# EAGLE board tarjeta-v8 (EAGLE 6.4)
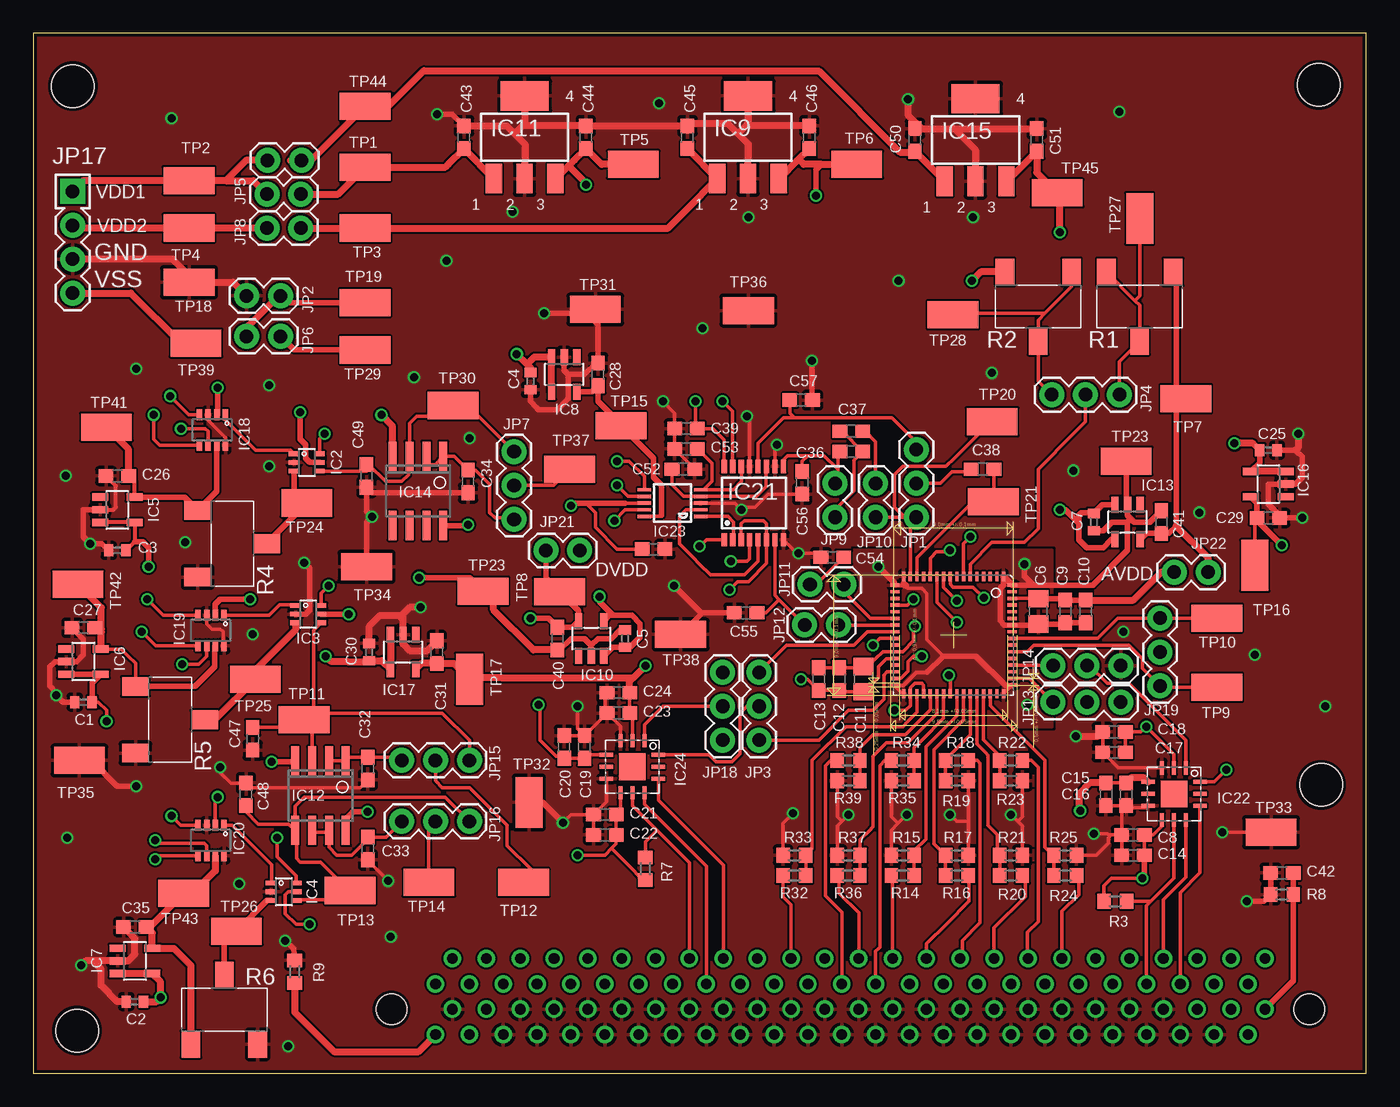
[diagram p3: board, top side]
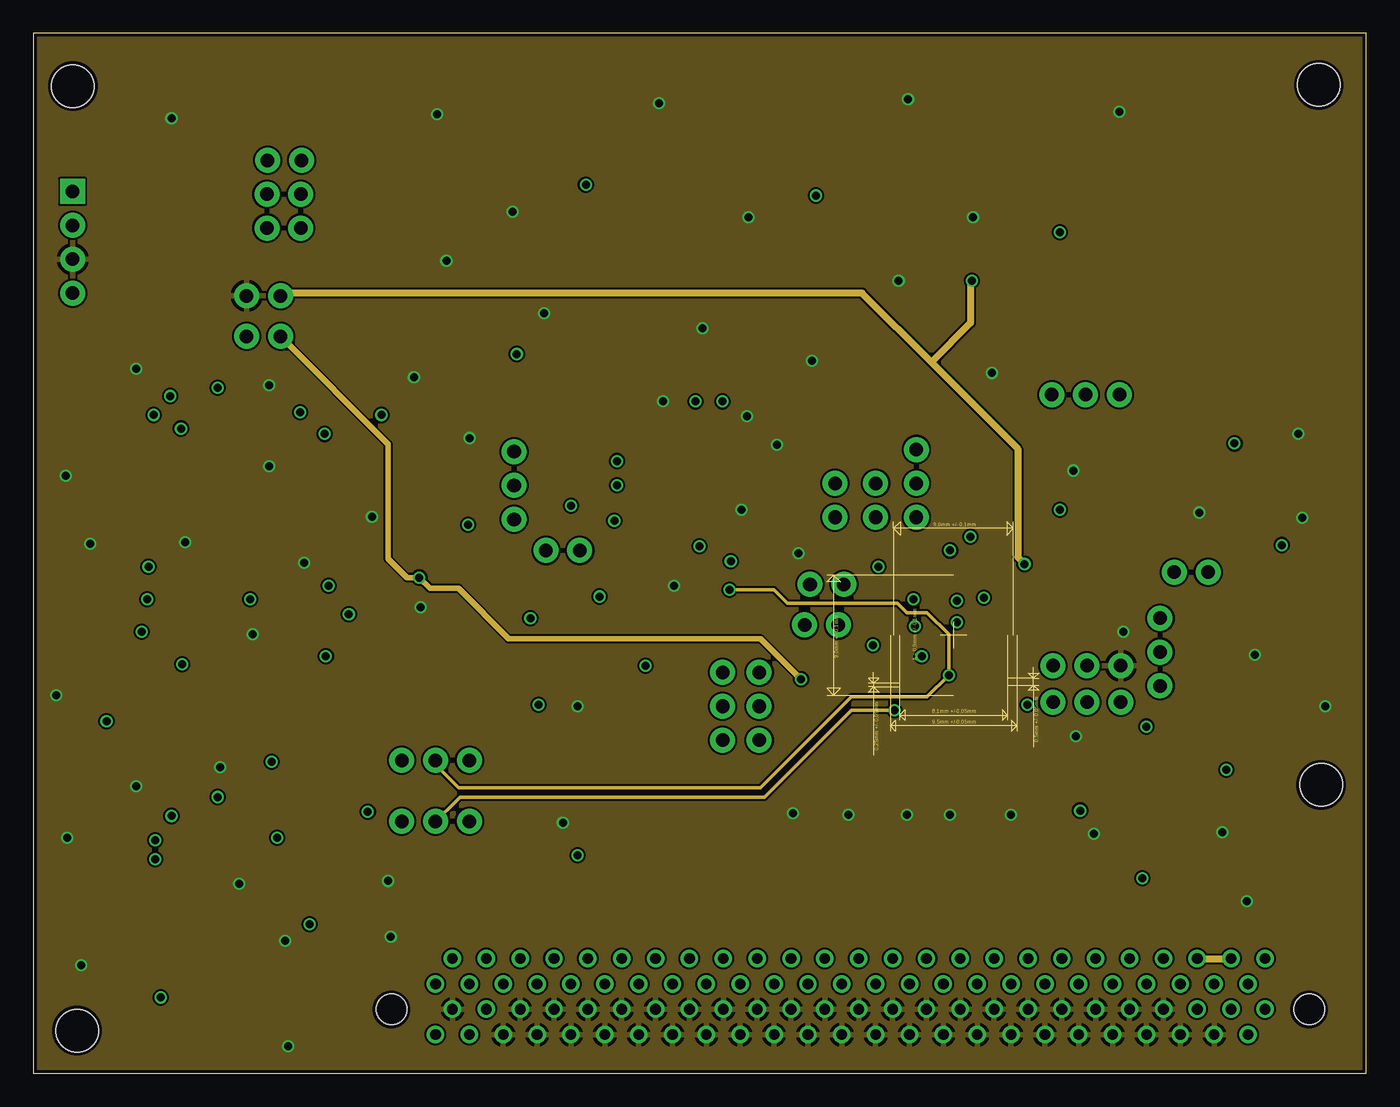
[diagram p4: board, inner layer Route2]
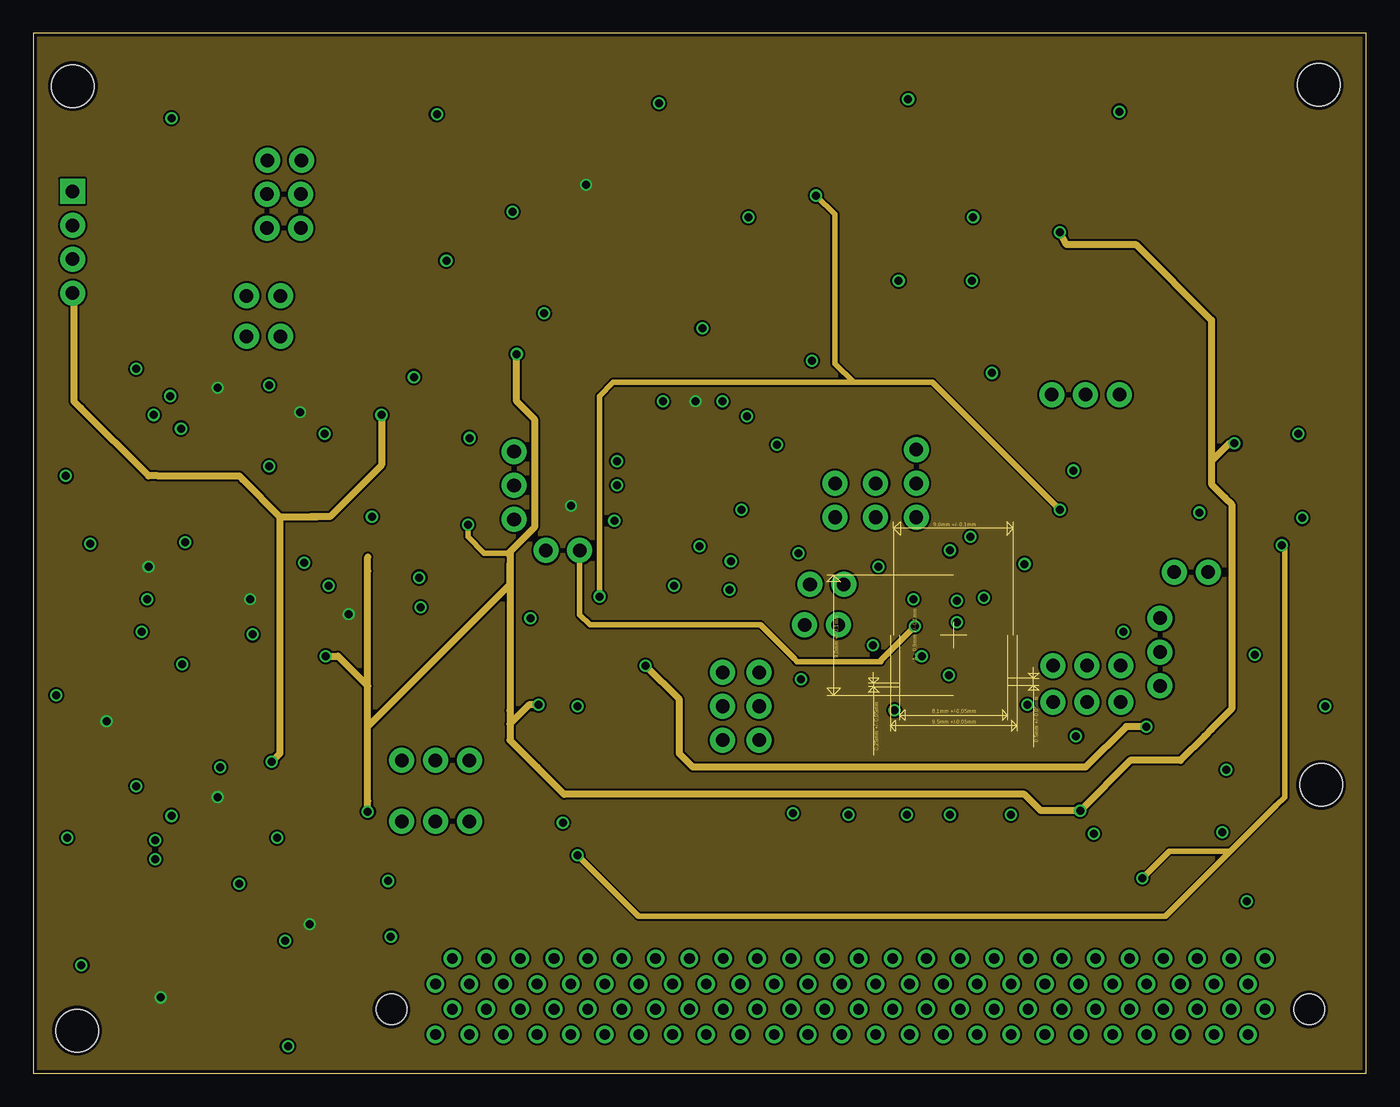
[diagram p5: board, inner layer Route3]
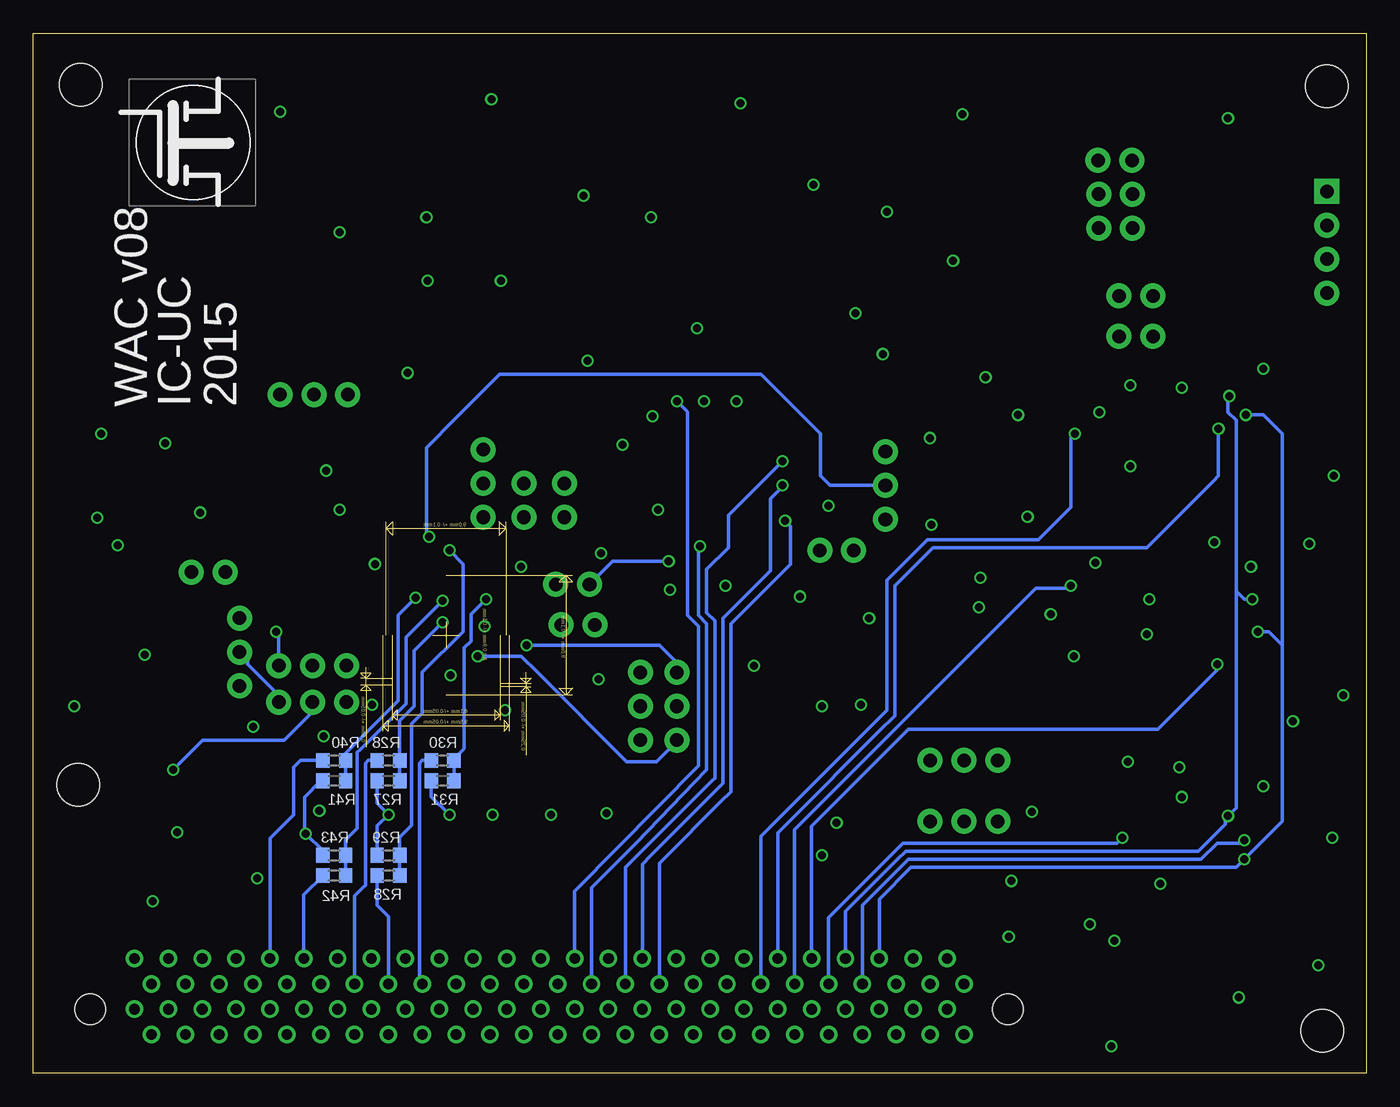
[diagram p6: board, bottom side, seen from below]

Size 100 x 78 mm. Coordinates in mm from the lower left corner, seen from the top.
Outline: 0,0 97.94,0 98.55,0 100,0 99.99,78 0,78 0,0
Copper layers [2:(1*2*3*16):3]: Top 0.035mm / dielectric 1.5mm / Route2 0.035mm / dielectric 0.15mm / Route3 0.035mm / dielectric 0.2mm / Bottom 0.035mm
Design rules "ITEADstudio_DRC": minimum track width 6mil, minimum drill 12mil, track to track 6mil, track to pad 6mil, pad to pad 6mil, via to via 6mil, smd to smd 0mil, copper to edge 10mil, drill to drill 10mil, minimum pad ring 10mil, minimum via ring 6mil, stop-mask expansion 2mil, vias tented up to drill 100mil, thermal gap 10mil
Holes 3.2 mm at 3.28,3.2 2.97,74.04 96.45,74.14 96.62,21.64

## Footprints (pad centres in the part's own frame; a part is rotated, then mirrored left to right if it is on the bottom)
C0402 = smd 0.7 x 0.9: 1 -0.65,0; 2 0.65,0
C0805 = smd 1.3 x 1.5: 1 -0.95,0; 2 0.95,0
C0603 = smd 1.1 x 1: 1 -0.85,0; 2 0.85,0
QFN64 = smd 0.7 x 0.25: 1 -14.56,5.02; 2 -14.56,4.52; 3 -14.56,4.02; 4 -14.56,3.52; 5 -14.56,3.02; 6 -14.56,2.52; 7 -14.56,2.02; 8 -14.56,1.52; 9 -14.56,1.02; 10 -14.56,0.52; 11 -14.56,0.02; 12 -14.56,-0.48; 13 -14.56,-0.98; 14 -14.56,-1.48; 15 -14.56,-1.98; 16 -14.56,-2.48; 33 -5.76,-2.48; 34 -5.76,-1.98; 35 -5.76,-1.48; 36 -5.76,-0.98; 37 -5.76,-0.48; 38 -5.76,0.02; 39 -5.76,0.52; 40 -5.76,1.02; 41 -5.76,1.52; 42 -5.76,2.02; 43 -5.76,2.52; 44 -5.76,3.02; 45 -5.76,3.52; 46 -5.76,4.02; 47 -5.76,4.52; 48 -5.76,5.02 | smd 0.25 x 0.7: 17 -13.91,-3.13; 18 -13.41,-3.13; 19 -12.91,-3.13; 20 -12.41,-3.13; 21 -11.91,-3.13; 22 -11.41,-3.13; 23 -10.91,-3.13; 24 -10.41,-3.13; 25 -9.91,-3.13; 26 -9.41,-3.13; 27 -8.91,-3.13; 28 -8.41,-3.13; 29 -7.91,-3.13; 30 -7.41,-3.13; 31 -6.91,-3.13; 32 -6.41,-3.13; 49 -6.41,5.67; 50 -6.91,5.67; 51 -7.41,5.67; 52 -7.91,5.67; 53 -8.41,5.67; 54 -8.91,5.67; 55 -9.41,5.67; 56 -9.91,5.67; 57 -10.41,5.67; 58 -10.91,5.67; 59 -11.41,5.67; 60 -11.91,5.67; 61 -12.41,5.67; 62 -12.91,5.67; 63 -13.41,5.67; 64 -13.91,5.67
SC70 = smd 0.35 x 0.8: 1 -0.65,-0.95; 2 0,-0.95; 3 0.65,-0.95; 4 0.65,0.95; 5 0,0.95; 6 -0.65,0.95
SOT23-5L_2 = smd 0.55 x 1.2: 1 -0.95,-1.3; 2 0,-1.3; 3 0.95,-1.3; 4 0.95,1.3; 5 -0.95,1.3
SOT223 = smd 1.219 x 2.235: 1 -2.438,-3.099; 2 -0.127,-3.099; 3 2.184,-3.099 | smd 3.6 x 2.2: 4 -0.127,3.099
SOIC8 = smd 0.6 x 2.2: 1 -1.905,-2.6; 2 -0.635,-2.6; 3 0.635,-2.6; 4 1.905,-2.6; 5 1.905,2.6; 6 0.635,2.6; 7 -0.635,2.6; 8 -1.905,2.6
SOT23-8_2 = smd 0.406 x 0.813: 1 -1,-1.04; 2 -0.35,-1.04; 3 0.3,-1.04; 4 0.95,-1.04; 5 0.95,1.26; 6 0.3,1.26; 7 -0.35,1.26; 8 -1,1.26
QSOP16 = smd 0.4 x 1: 1 -2.223,-2.75; 2 -1.588,-2.75; 3 -0.953,-2.75; 4 -0.318,-2.75; 5 0.318,-2.75; 6 0.953,-2.75; 7 1.588,-2.75; 8 2.223,-2.75; 9 2.223,2.75; 10 1.588,2.75; 11 0.953,2.75; 12 0.318,2.75; 13 -0.318,2.75; 14 -0.953,2.75; 15 -1.588,2.75; 16 -2.223,2.75
TQFN12 = smd 1 x 0.3: P$1 0.05,-1.1; P$2 0.05,-2; P$3 0.05,-2.9; P$7 3.95,-2.9; P$8 3.95,-2; P$9 3.95,-1.1 | smd 0.3 x 1: P$4 1.1,-3.95; P$5 2,-3.95; P$6 2.9,-3.95; P$10 2.9,-0.05; P$11 2,-0.05; P$12 1.1,-0.05 | smd 2 x 2: P$13 2,-2
MSOP10 = smd 0.25 x 1: 1 -1,-2.113; 2 -0.5,-2.113; 3 0,-2.113; 4 0.5,-2.113; 5 1,-2.113; 6 1,2.113; 7 0.5,2.113; 8 0,2.113; 9 -0.5,2.113; 10 -1,2.113
FX2-100S-1.27 = drill 0.8: A1 0,0; A2 -1.27,-1.905; A3 -2.54,0; A4 -3.81,-1.905; A5 -5.08,0; A6 -6.35,-1.905; A7 -7.62,0; A8 -8.89,-1.905; A9 -10.16,0; A10 -11.43,-1.905; A11 -12.7,0; A12 -13.97,-1.905; A13 -15.24,0; A14 -16.51,-1.905; A15 -17.78,0; A16 -19.05,-1.905; A17 -20.32,0; A18 -21.59,-1.905; A19 -22.86,0; A20 -24.13,-1.905; A21 -25.4,0; A22 -26.67,-1.905; A23 -27.94,0; A24 -29.21,-1.905; A25 -30.48,0; A26 -31.75,-1.905; A27 -33.02,0; A28 -34.29,-1.905; A29 -35.56,0; A30 -36.83,-1.905; A31 -38.1,0; A32 -39.37,-1.905; A33 -40.64,0; A34 -41.91,-1.905; A35 -43.18,0; A36 -44.45,-1.905; A37 -45.72,0; A38 -46.99,-1.905; A39 -48.26,0; A40 -49.53,-1.905; A41 -50.8,0; A42 -52.07,-1.905; A43 -53.34,0; A44 -54.61,-1.905; A45 -55.88,0; A46 -57.15,-1.905; A47 -58.42,0; A48 -59.69,-1.905; A49 -60.96,0; A50 -62.23,-1.905; B1 0,3.8; B2 -1.27,1.895; B3 -2.54,3.8; B4 -3.81,1.895; B5 -5.08,3.8; B6 -6.35,1.895; B7 -7.62,3.8; B8 -8.89,1.895; B9 -10.16,3.8; B10 -11.43,1.895; B11 -12.7,3.8; B12 -13.97,1.895; B13 -15.24,3.8; B14 -16.51,1.895; B15 -17.78,3.8; B16 -19.05,1.895; B17 -20.32,3.8; B18 -21.59,1.895; B19 -22.86,3.8; B20 -24.13,1.895; B21 -25.4,3.8; B22 -26.67,1.895; B23 -27.94,3.8; B24 -29.21,1.895; B25 -30.48,3.8; B26 -31.75,1.895; B27 -33.02,3.8; B28 -34.29,1.895; B29 -35.56,3.8; B30 -36.83,1.895; B31 -38.1,3.8; B32 -39.37,1.895; B33 -40.64,3.8; B34 -41.91,1.895; B35 -43.18,3.8; B36 -44.45,1.895; B37 -45.72,3.8; B38 -46.99,1.895; B39 -48.26,3.8; B40 -49.53,1.895; B41 -50.8,3.8; B42 -52.07,1.895; B43 -53.34,3.8; B44 -54.61,1.895; B45 -55.88,3.8; B46 -57.15,1.895; B47 -58.42,3.8; B48 -59.69,1.895; B49 -60.96,3.8; B50 -62.23,1.895 | hole 2.3: -65.54,1.905; 3.31,1.905
1X03 = drill 1.016 pad 1.88: 1 -2.54,0; 2 0,0; 3 2.54,0
1X02 = drill 1.016 pad 1.88: 1 -1.27,0; 2 1.27,0
1X04 = drill 1.016 pad 1.88 square: 1 0,0 | drill 1.016 pad 1.88: 2 2.54,0; 3 5.08,0; 4 7.62,0
ST-5EW = smd 1.4 x 2: 1 -2.5,-2.6; 2 0,2.6; 3 2.5,-2.6
R0603 = smd 1 x 1.1: 1 -0.85,0; 2 0.85,0
TP = smd 3.81 x 2.032: TP 0,0

## Placement (x,y rotation side)
C1  [C0402]  3.76,27.84 180 top
C2  4.7uf  [C0402]  7.62,5.38 180 top
C3  [C0402]  6.3,39.22 180 top
C4  4.7uf  [C0402]  37.29,51.92 270 top
C5  [C0402]  44.4,32.61 90 top
C6  [C0805]  75.39,34.65 270 top
C7  [C0402]  79.55,41.35 270 top
C8  CAP_0603  [C0603]  82.5,17.88 180 top
C9  CAP_0603  [C0603]  77.42,34.65 270 top
C10  CAP_0603  [C0603]  78.94,34.65 270 top
C11  [C0805]  62.28,29.57 270 top
C12  CAP_0603  [C0603]  60.45,29.57 270 top
C13  CAP_0603  [C0603]  58.93,29.57 270 top
C14  CAP_0603  [C0603]  82.5,16.36 180 top
C15  CAP_0603  [C0603]  81.99,20.93 270 top
C16  CAP_0603  [C0603]  80.47,20.93 270 top
C17  CAP_0603  [C0603]  81.08,24.08 180 top
C18  CAP_0603  [C0603]  81.08,25.6 180 top
C19  CAP_0603  [C0603]  41.35,24.49 90 top
C20  CAP_0603  [C0603]  39.83,24.49 90 top
C21  CAP_0603  [C0603]  42.88,19.41 180 top
C22  CAP_0603  [C0603]  42.88,17.88 180 top
C23  CAP_0603  [C0603]  43.89,27.03 180 top
C24  CAP_0603  [C0603]  43.89,28.55 180 top
C25  [C0402]  92.66,46.74 0 top
C26  CAP_0603  [C0603]  6.3,44.81 180 top
C27  CAP_0603  [C0603]  3.76,33.43 180 top
C28  0.1uf  [C0603]  42.37,52.43 90 top
C29  0.1uf  [C0603]  92.66,41.66 0 top
C30  4.7uf  [C0402]  25.2,31.6 90 top
C31  0.1uf  [C0603]  30.28,31.6 90 top
C32  CAP_0603  [C0603]  25.1,22.86 270 top
C33  CAP_0603  [C0603]  25.1,16.87 270 top
C34  4.7uf  [C0603]  32.62,44.4 270 top
C35  0.1uf  [C0603]  7.62,10.97 180 top
C36  CAP_0603  [C0603]  61.37,46.63 0 top
C37  CAP_0603  [C0603]  61.37,48.16 0 top
C38  CAP_0603  [C0603]  71.22,45.31 0 top
C39  0.1uF  [C0603]  48.97,48.36 0 top
C40  CAP_0603  [C0603]  39.32,32.61 270 top
C41  CAP_0603  [C0603]  84.63,41.35 90 top
C42  1nf  [C0603]  93.68,15.04 180 top
C43  CAP_0603  [C0603]  32.31,70.21 90 top
C44  CAP_0603  [C0603]  41.45,70.21 90 top
C45  CAP_0603  [C0603]  49.07,70.21 90 top
C46  CAP_0603  [C0603]  58.22,70.21 90 top
C47  CAP_0603  [C0603]  16.46,25.1 270 top
C48  CAP_0603  [C0603]  15.95,20.93 90 top
C49  CAP_0603  [C0603]  25,44.81 270 top
C50  CAP_0603  [C0603]  66.14,70 90 top
C51  CAP_0603  [C0603]  75.29,70 90 top
C52  CAP_0603  [C0603]  48.77,45.31 0 top
C53  CAP_0603  [C0603]  48.97,46.84 180 top
C54  CAP_0603  [C0603]  59.95,38.71 180 top
C55  CAP_0603  [C0603]  53.44,34.54 180 top
C56  CAP_0603  [C0603]  57.69,44.3 270 top
C57  CAP_0603  [C0603]  57.61,50.5 0 top
C58  0.1uF  [C0603]  46.53,39.32 180 top
IC1  THE_BEAN_2  [QFN64]  67.77,22.71 270 top
IC2  [SC70]  20.52,45.82 270 top
IC3  [SC70]  20.63,34.44 270 top
IC4  [SC70]  18.8,13.61 270 top
IC5  1.8V  [SOT23-5L_2]  6.3,42.27 270 top
IC6  1.8V  [SOT23-5L_2]  3.76,30.89 270 top
IC7  1.8V  [SOT23-5L_2]  7.62,8.43 270 top
IC8  1.8V  [SOT23-5L_2]  39.83,52.43 180 top
IC9  [SOT223]  53.75,70.21 0 top
IC10  1.8  [SOT23-5L_2]  41.86,32.61 0 top
IC11  [SOT223]  36.98,70.21 0 top
IC12  OP282  [SOIC8]  21.54,20.83 180 top
IC13  1.8  [SOT23-5L_2]  82.09,41.35 180 top
IC14  OP282  [SOIC8]  28.86,43.69 180 top
IC15  [SOT223]  70.82,70 0 top
IC16  1.8V  [SOT23-5L_2]  92.66,44.2 90 top
IC17  1.8V  [SOT23-5L_2]  27.74,31.6 180 top
IC18  AD5160_2  [SOT23-8_2]  13.41,48.36 180 top
IC19  AD5160_2  [SOT23-8_2]  13.31,33.32 180 top
IC20  AD5160_2  [SOT23-8_2]  13.31,17.58 180 top
IC21  [QSOP16]  54.05,42.77 0 top
IC22  [TQFN12]  87.58,22.96 270 top
IC23  DAC7554  [MSOP10]  47.96,42.77 90 top
IC24  [TQFN12]  46.94,24.99 270 top
J1  HIRESO_FX_CONNECTOR  [FX2-100S-1.27]  30.18,6.71 180 top
JP1  JUMPER03  [1X03]  66.24,44.25 270 top
JP2  JUMPER02  [1X02]  17.27,58.32 0 top
JP3  JUMPER03  [1X03]  54.46,27.53 90 top
JP4  JUMPER03  [1X03]  78.94,50.9 0 top
JP5  JUMPER02  [1X02]  18.8,65.94 180 top
JP6  JUMPER02  [1X02]  17.27,55.27 180 top
JP7  JUMPER03  [1X03]  36.07,44.09 90 top
JP8  JUMPER02  [1X02]  18.8,63.4 180 top
JP9  JUMPER02  [1X02]  60.15,42.98 270 top
JP10  JUMPER02  [1X02]  63.2,42.98 270 top
JP11  JUMPER02  [1X02]  59.54,36.68 0 top
JP12  JUMPER02  [1X02]  59.13,33.63 0 top
JP13  JUMPER03  [1X03]  79.05,27.84 180 top
JP14  JUMPER03  [1X03]  79.05,30.58 180 top
JP15  JUMPER03  [1X03]  30.18,23.47 0 top
JP16  JUMPER03  [1X03]  30.18,18.9 0 top
JP17  JUMPER04  [1X04]  2.95,66.14 270 top
JP18  JUMPER03  [1X03]  51.72,27.53 90 top
JP19  JUMPER03  [1X03]  84.53,31.6 270 top
JP20  JUMPER02  [1X02]  18.85,68.48 180 top
JP21  JUMPER02  [1X02]  39.73,39.22 0 top
JP22  JUMPER02  [1X02]  86.87,37.59 0 top
R1  [ST-5EW]  83.01,57.51 180 top
R2  [ST-5EW]  75.39,57.51 180 top
R3  RES_0603  [R0603]  81.18,12.9 180 top
R4  [ST-5EW]  14.94,39.73 270 top
R5  [ST-5EW]  10.26,26.52 270 top
R6  [ST-5EW]  14.33,4.78 0 top
R7  RES_0603  [R0603]  45.92,15.34 270 top
R8  1M  [R0603]  93.68,13.41 0 top
R9  RES_0603  [R0603]  19.61,7.62 270 top
R14  RES_0603  [R0603]  65.23,14.83 180 top
R15  RES_0603  [R0603]  65.23,16.36 0 top
R16  RES_0603  [R0603]  69.29,14.83 0 top
R17  RES_0603  [R0603]  69.29,16.36 180 top
R18  RES_0603  [R0603]  69.29,23.47 0 top
R19  RES_0603  [R0603]  69.29,21.95 180 top
R20  RES_0603  [R0603]  73.36,14.83 0 top
R21  RES_0603  [R0603]  73.36,16.36 180 top
R22  RES_0603  [R0603]  73.36,23.47 0 top
R23  RES_0603  [R0603]  73.36,21.95 180 top
R24  RES_0603  [R0603]  77.42,14.83 0 top
R25  RES_0603  [R0603]  77.42,16.36 180 top
R26  RES_0603  [R0603]  73.36,23.47 180 bottom
R27  RES_0603  [R0603]  73.36,21.95 0 bottom
R28  RES_0603  [R0603]  73.36,14.83 180 bottom
R29  RES_0603  [R0603]  73.36,16.36 0 bottom
R30  RES_0603  [R0603]  69.29,23.47 180 bottom
R31  RES_0603  [R0603]  69.29,21.95 0 bottom
R32  RES_0603  [R0603]  57.1,14.83 180 top
R33  RES_0603  [R0603]  57.1,16.36 0 top
R34  0  [R0603]  65.23,23.47 180 top
R35  0  [R0603]  65.23,21.95 0 top
R36  RES_0603  [R0603]  61.16,14.83 180 top
R37  RES_0603  [R0603]  61.16,16.36 0 top
R38  RES_0603  [R0603]  61.16,23.47 180 top
R39  RES_0603  [R0603]  61.16,21.95 0 top
R40  RES_0603  [R0603]  77.42,23.47 180 bottom
R41  RES_0603  [R0603]  77.42,21.95 0 bottom
R42  RES_0603  [R0603]  77.42,14.83 180 bottom
R43  RES_0603  [R0603]  77.42,16.36 0 bottom
TP1  [TP]  24.89,67.97 0 top
TP2  [TP]  11.69,66.95 0 top
TP3  [TP]  24.89,63.4 0 top
TP4  [TP]  11.69,63.4 0 top
TP5  [TP]  45.01,68.17 0 top
TP6  [TP]  61.77,68.17 0 top
TP7  [TP]  86.46,50.6 180 top
TP8  [TP]  39.47,36.12 0 top
TP9  [TP]  88.8,28.96 0 top
TP10  [TP]  88.8,34.14 0 top
TP11  [TP]  20.32,26.52 0 top
TP12  [TP]  36.78,14.33 0 top
TP13  [TP]  23.78,13.72 0 top
TP14  [TP]  29.67,14.33 0 top
TP15  [TP]  44.1,48.56 0 top
TP16  [TP]  91.64,38.1 90 top
TP17  [TP]  32.72,29.57 270 top
TP18  [TP]  11.69,59.33 0 top
TP19  [TP]  24.89,57.81 0 top
TP20  [TP]  71.93,48.87 180 top
TP21  [TP]  72.04,42.88 180 top
TP22  [TP]  81.99,45.92 0 top
TP23  [TP]  33.73,36.17 0 top
TP24  [TP]  20.52,42.77 0 top
TP25  [TP]  16.66,29.57 0 top
TP26  [TP]  15.24,10.67 0 top
TP27  [TP]  83.01,64.11 90 top
TP28  [TP]  68.99,56.9 180 top
TP29  [TP]  24.89,54.25 0 top
TP30  [TP]  31.5,50.09 0 top
TP31  [TP]  42.17,57.3 0 top
TP32  [TP]  37.19,20.32 90 top
TP33  [TP]  92.86,18.08 0 top
TP34  [TP]  25,38 0 top
TP35  [TP]  3.46,23.47 0 top
TP36  [TP]  53.65,57.2 0 top
TP37  [TP]  40.24,45.31 0 top
TP38  [TP]  48.57,32.92 0 top
TP39  [TP]  12.19,54.76 0 top
TP41  [TP]  5.49,48.46 0 top
TP42  [TP]  3.35,36.68 0 top
TP43  [TP]  11.28,13.51 0 top
TP44  [TP]  24.89,72.54 0 top
TP45  [TP]  76.81,66.04 0 top
U$1  LOGO  [LOGO]  83.31,74.57 270 top

## Tracks (layer width: path | path; a pad name or v marks a point on that pad's centre or on a via)
!CS_ADC1
  Top 0.254: IC22.P$9 86.48,14.71 84.79,13.02 J1.A44
!CS_ADC2
  Top 0.254: IC24.P$9 45.84,20.2 50.29,15.75 50.5,15.54 J1.A17
!CS_DAC  (via drill 0.6)
  Top 0.254: IC23.9 44.41,42.27 v43.59,41.45
  Bottom 0.254: v43.59,41.45 43.18,41.05 43.18,38.2 47.25,34.14 47.65,33.73 47.65,21.54 47.65,21.13 48.46,20.32 52.68,16.1 53.04,15.75 J1.A19
ADC1_IN+  (via drill 0.6)
  Top 0.254: IC22.P$12 88.61,21.86 v89.51,22.76
  Bottom 0.254: JP13.2 79.05,27.13 81.18,24.99 87.28,24.99 v89.51,22.76
ADC1_IN-
  Top 0.254: JP14.2 79.25,30.58 80.57,29.26 82.2,29.26 84.02,27.43 86.48,24.98 IC22.P$1
ADC2_IN+
  Top 0.254: JP3.2 53.54,27.53 53.04,27.03 53.04,23.98 52.53,23.47 52.43,23.37 51.21,23.37 50.68,23.89 IC24.P$12
ADC2_IN-
  Top 0.254: JP18.2 47.25,27.53 45.92,26.21 45.84,26.13 IC24.P$1
AGND  (via drill 0.6)
  Top 0.254: IC1.48 IC1.49 | 81.99,42.75 IC13.2 | IC1.16 65.29,36.72 | IC1.32 64.64,29.04 65.23,28.45 | 64.62,36.78 64.62,36.58 65.43,36.58 65.64,36.37 66.65,36.37 67.06,35.97 67.06,32.51 68.28,31.29
  Top 0.305: IC1.32 65.29,29.12 66.24,30.07 67.06,30.07
  Top 0.406: 18.39,58.32 JP2.2 19.05,57.81 TP19.TP | 16.16,55.42 JP6.2 | C10.2 C9.2 77.32,33.7 C6.2 75.31,33.62 IC1.58 72.86,33.62 72.54,33.93 72.54,36.37 72.79,36.62 IC1.1 IC1.64 75.02,36.62 | IC13.2 82.09,41.86 82.35,41.6 | 82.35,41.6 82.6,41.35 83.78,41.35 C41.2 84.74,42.3 | C7.2 80.27,40.7 80.92,41.35 82.09,41.35 | 82.09,41.35 82.35,41.6 | 75.02,36.62 79.49,36.62 82.09,39.22 82.09,41.35 | v74.37,38.2 74.37,37.27 75.02,36.62 | TP22.TP 81.99,42.75 | 64.62,36.78 v63.4,38 63.4,38.2 | 67.06,30.07 68.28,31.29 70.72,31.29 72.95,29.06 73.38,29.06 IC1.49
  Top 0.508: 18.39,58.32 16.16,56.08 16.16,55.42 | v70.41,59.44 71.08,60.11 R2.3 | 65.29,36.72 65.43,36.58
  Route2 0.406: JP2.2 18.39,58.32
  Route2 0.508: 67.36,53.34 62.18,58.52 18.75,58.52 JP2.2 | 67.36,53.34 73.86,46.84 73.86,38.71 v74.37,38.2 | 67.36,53.34 70.31,56.29 70.31,59.33 v70.41,59.44
  other vias: 74.58,27.64
  pour Top: 76.4,39.22 60.66,39.22 60.66,26.01 76.4,26.01
AVDD
  Top 0.406: IC13.5 83.49,40.5 C41.1 85.21,40.5 85.75,41.05 85.75,50.7 | 85.85,60.55 85.85,60.45 R1.1 85.75,59.86 85.75,50.7 | TP7.TP 85.85,50.6 85.75,50.7
  Top 0.508: JP22.2 88.14,38.66 85.75,41.05
AVDD_BEAN
  Top 0.254: IC1.62 75.37,35.62 C6.1
  Top 0.406: C10.1 C9.1 77.32,35.6 C6.1
  Top 0.508: C10.1 82.54,35.5 84.63,37.59 JP22.1
BASELINE
  Top 0.254: IC1.56 79.86,32.62 81.38,34.14 JP19.1 TP10.TP
CAP_PRECHAR
  Top 0.254: C38.2 72.07,42.91 TP21.TP 71.83,42.67 70.31,42.67 66.29,38.65 IC1.14
CAP_PRECHAR_1
  Top 0.254: JP1.1 66.24,47.35 64.42,49.17 57.3,49.17 57.1,49.17 | IC21.12 54.36,45.54 54.36,47.24 56.29,49.17 57.1,49.17 | C57.1 56.76,49.52 57.1,49.17
CLK  (via drill 0.6)
  Top 0.254: IC1.20 65.6,35.12 v66.04,35.56
  Bottom 0.254: R30.1 R31.2 68.44,23.61 67.77,24.28 67.67,24.38 67.67,31.9 67.16,32.41 67.16,34.44 v66.04,35.56
CLK_ADC1
  Top 0.254: IC22.P$10 87.53,15.04 86.06,13.56 J1.A45
CLK_ADC2
  Top 0.254: IC24.P$10 46.89,20.47 51.77,15.6 J1.A18
CLK_DAC  (via drill 0.6)
  Top 0.254: IC23.6 45.84,44.78 44.71,45.92 v43.79,45.92
  Bottom 0.254: v43.79,45.92 47.86,41.86 47.86,39.42 49.48,37.8 49.48,34.75 49.48,34.54 48.87,33.93 48.87,22.35 48.87,22.15 49.07,21.95 55.53,15.49 55.58,15.44 J1.A21
CLK_PRECH1  (via drill 0.6)
  Top 0.254: IC1.9 68.79,36.67 68.99,36.47 70.51,36.47 v71.32,35.66
  Bottom 0.254: v71.32,35.66 72.65,34.34 72.65,27.94 72.85,27.74 76.57,24.02 R40.1 R41.2
CLK_PRECH1_T
  Bottom 0.254: 80.47,21.44 80.47,20.93 | 80.47,20.93 80.47,19.41 81.94,17.93 82.25,17.63 J1.A42 | R40.2 79.96,23.47 80.47,22.96 80.47,20.93
CLK_PRECH2  (via drill 0.6)
  Top 0.254: IC1.10 68.29,36.46 v69.29,35.46
  Bottom 0.254: v69.29,35.46 72.04,32.72 72.04,27.74 75.49,24.28 75.69,24.08 75.69,18.39 76.57,17.51 R43.2 R42.1
CLK_PRECH2_T
  Bottom 0.254: J1.A40 79.71,13.4 R42.2
CLK_REF  (via drill 0.6)
  Top 0.254: IC18.4 11.66,49.4 v10.26,50.8 | IC20.4 11.05,18.62 v10.36,19.3 | IC19.4 9.73,34.37 v8.54,35.56
  Bottom 0.254: J1.A8 39.07,12.14 35.16,16.05 34.55,16.66 12.6,16.66 12.19,17.07 10.57,18.69 10.57,19.1 v10.36,19.3 9.76,19.91 9.76,36.17 | v10.26,50.8 10.36,50.7 10.36,49.58 9.76,48.97 9.76,36.17 | v8.54,35.56 9.15,35.56 9.76,36.17
CLK_T
  Bottom 0.254: R30.2 70.82,23.47 71.02,23.27 71.02,13.92 71.02,6.91 J1.A33
CS_B0
  Top 0.254: R14.1 R15.2 66.08,16.7 66.96,17.58 66.96,24.49 69.19,26.72 69.29,26.82 IC1.41
CS_B0_T
  Top 0.254: 64.31,14.77 R14.2 64.47,14.75 64.47,13.66 J1.A28
CS_B1
  Top 0.254: R16.1 R17.2 67.57,17.23 67.57,24.28 69.79,26.51 IC1.42
CS_B1_T
  Top 0.254: R16.2 70.21,14.77 70.21,12.9 68.53,11.23 67.01,9.7 J1.A30
CS_B2
  Top 0.254: IC1.43 70.29,25.38 69.8,24.89 68.58,23.67 68.44,23.53 R18.1 R19.2
CS_B2_T
  Top 0.254: R18.2 70.82,23.47 71.02,23.27 71.02,21.44 71.02,11.28 69.7,9.96 69.7,8.76 J1.A32
CS_B3
  Top 0.254: R20.1 R21.2 72.34,16.52 72.34,17.88 71.63,18.59 71.63,23.88 71.43,24.08 70.79,24.72 IC1.44
CS_B3_T
  Top 0.254: 74.37,14.67 R20.2 74.42,14.62 74.42,13.26 72.09,10.92 J1.A34
CS_B4
  Top 0.254: IC1.45 71.29,25.03 72.34,23.98 72.34,23.64 R22.1 R23.2
CS_B4_T
  Top 0.254: R22.2 74.88,23.47 75.39,22.96 75.39,21.44 75.39,19.91 75.39,17.88 75.39,13.82 75.39,11.38 74.58,10.57 74.58,8.66 J1.A36
CS_B5
  Top 0.254: R24.1 R25.2 76.51,16.36 75.9,16.97 75.9,23.47 75.59,23.77 73.86,25.5 71.79,27.58 IC1.46
CS_B5_T
  Top 0.254: J1.A38 77.17,12.14 78.44,13.41 78.44,14.67 R24.2
  Top 0.406: 78.44,14.67 R24.2
CS_REF_1  (via drill 0.6)
  Top 0.254: IC18.6 13.11,48.15 12.9,48.36 v11.08,48.36
  Bottom 0.254: J1.A12 44.15,18.03 43.28,18.9 36.58,25.6 35.36,26.82 35.36,36.58 32.51,39.42 16.46,39.42 16.05,39.83 11.48,44.4 11.08,44.81 v11.08,48.36
CS_REF_2  (via drill 0.6)
  Top 0.254: IC19.6 13.01,31.3 12.4,30.68 v11.18,30.68
  Bottom 0.254: J1.A10 41.61,18.54 41.35,18.8 34.34,25.81 15.65,25.81 11.18,30.28 v11.18,30.68
CS_REF_3  (via drill 0.6)
  Top 0.254: IC20.6 13.01,16.66 13.01,17.06 13.01,17.07 12.8,17.27 12.4,17.27 9.35,17.27 v9.15,17.48
  Bottom 0.254: J1.A7 37.8,12.6 34.34,16.05 12.4,16.05 11.18,17.27 9.35,17.27 v9.15,17.48
DGND  (via drill 0.6)
  Top 0.254: IC1.28 64.61,31.09 64.01,31.09 63.4,30.48 63.4,29.67 62.35,28.62 C11.2 60.55,28.62 C12.2 C13.2 58.08,29.57 v57.61,29.57
  Top 0.406: C40.2 39.49,31.76 40.34,32.61 41.35,32.61 41.86,32.11 | 41.86,32.11 IC10.2 | C5.2 44.03,33.26 43.38,32.61 42.37,32.61 41.86,32.11 | TP29.TP 19.56,54.25 JP6.1 | v28.96,37.19 32.72,37.19 TP23.TP 34.55,35.36
  Top 0.508: C40.2 37.53,31.76 34.55,34.75 34.55,35.36
  Route2 0.406: v57.61,29.57 54.56,32.61 37.8,32.61 35.66,32.61 31.9,36.37 29.77,36.37 v28.96,37.19 28.04,37.19 26.62,38.61 26.62,45.11 26.62,47.19 JP6.1
DVDD  (via drill 0.6)
  Top 0.406: v37.29,34.14 38.65,34.14 C40.1 40.46,33.46 IC10.5 40.91,34.68 TP8.TP 38.46,37.13 JP21.1
DVDD_BEAN  (via drill 0.6)
  Top 0.254: C13.1 C12.1 62.18,30.42 C11.1 | v66.14,33.53 66.04,33.43 66.04,32.43 65.23,31.62 IC1.27 63.72,31.62 63.2,31.09 62.79,30.68 62.45,30.68
  Top 0.406: C11.1 62.45,30.68
  Route3 0.406: v66.14,33.53 64.01,31.39 63.6,30.99 63.6,30.89 57.3,30.89 57.1,31.09 54.56,33.63 41.76,33.63 41,34.39 JP21.2
GND  (via drill 0.6)
  Top 0.254: IC18.3 13.11,48.97 14.23,47.85 | 14.23,47.85 14.33,47.75 | IC18.8 14.41,47.67 14.23,47.85 | C52.2 49.62,45.34 C53.2 C39.1 48.12,49.52 v47.25,50.39 | C48.2 15.95,21.64 | C16.2 C15.2 | 73.86,18.9 74.21,19.24 R27.1 | 73.86,18.9 v73.36,19.41 | R29.1 74.21,18.56 73.86,18.9 | 70.14,18.9 R17.1 | R15.1 64.38,17.44 64.38,18.25 64.87,18.75 | R31.1 70.14,18.9 | 70.14,18.9 69.29,18.9 v68.78,19.41 | 64.87,18.75 v65.53,19.41 | R35.1 64.38,19.24 64.87,18.75 | R37.1 60.31,18.56 60.66,18.9 | 60.66,18.9 v61.16,19.41 | R39.1 60.31,19.24 60.66,18.9 | v14.02,22.96 14.02,22.55 14.84,21.74 15.92,21.74 C48.2 | C21.2 C22.2 | C19.2 C20.2 | C23.2 43.38,27.03 C23.2 | C23.2 42.88,27.03 | 42.88,27.03 42.88,28.38 C24.2 | IC24.P$3 44.04,26.03 C23.2 | v40.84,27.53 40.84,25.84 C19.2 | 42.88,27.03 42.88,26.86 C19.2 | IC24.P$6 42.99,20.37 C21.2 | C14.2 C8.2 | C15.2 81.99,19.91 83.48,19.91 IC22.P$6 | C18.2 C17.2 81.4,22.91 82.04,22.91 IC22.P$3 | IC23.3 52.63,42.77 v53.14,42.27 53.34,42.47 54.15,42.47 55.13,43.45 C56.2 | IC21.10 55.64,47 v55.78,47.14 | IC21.8 57.28,39.01 v57.41,39.01 58.79,39.01 C54.2 | IC21.13 53.73,49.09 v53.54,49.28 | R33.1 56.25,18.76 v57,19.51 | v89.21,18.09 93.47,18.09 TP33.TP | C21.2 40.34,19.41 v39.73,18.8 | 25.06,16.05 C33.2 | R43.1 79.15,16.36 79.76,16.36 80.67,17.27 80.67,17.68 80.88,17.88 | 80.88,17.88 80.67,17.88 80.57,17.98 79.96,17.98 v79.55,17.98 | 80.88,17.88 C8.2 | C8.2 81.65,19.74 C15.2 | 7.11,5.24 C2.2 | IC19.3 13.01,33.73 13.41,33.33 14.02,33.33 14.23,33.12 14.23,32.15 IC19.8 | 25,16.05 v26.62,14.43 | C32.2 24.52,21.44 19.71,21.44 16.29,21.44 C48.2
  Top 0.305: IC5.2 6,42.27 6.2,42.47 6.2,44.06 C26.2
  Top 0.406: IC5.2 3.76,42.27 3.76,40.23 v4.27,39.73 5.14,39.73 C3.2 5.79,39.08 | C27.2 3.76,32.58 3.76,31.39 3.25,30.89 IC6.2 1.63,30.89 1.22,30.48 1.22,29.06 1.73,28.55 v1.73,28.35 2.24,27.84 C1.2 | v30.28,71.93 31.43,71.93 C43.2 | C42.2 R8.1 92.32,12.9 v91.04,12.9 | 40.13,52.43 41.35,52.43 42.2,53.28 C28.2 42.37,55.47 42.37,56.19 41.66,56.9 | 40.13,52.43 39.93,52.63 39.83,52.73 IC8.2 | C25.2 94.69,46.74 95.2,46.23 95.2,44.7 94.69,44.2 IC16.2 92.66,44.2 92.66,42.67 93.51,41.82 C29.2 v95.2,41.66 | v58.42,53.44 58.42,50.53 C57.2 | C55.2 51.72,34.54 50.09,34.54 | C4.2 37.29,50.39 37.8,49.89 37.9,49.78 39.32,49.78 40.13,50.6 40.13,52.43 | v18.9,9.96 19.55,9.35 R9.1 | 50.09,34.54 v48.06,36.58 | 50.09,34.54 50.09,34.44 TP38.TP | TP32.TP 38.2,20.32 v39.73,18.8 | 41.66,56.9 41.25,57.3 TP31.TP 41.86,57 | v38.3,57 41.56,57 41.66,56.9 | IC3.2 20.42,34.44 20.73,34.75 20.73,37.9 v20.32,38.3 | TP35.TP 4.37,23.47 6.3,21.54 v7.72,21.54 | TP34.TP 25,41.35 v25.4,41.76 25,42.16 C49.2 25.4,43.55 C34.2
  Top 0.508: C35.2 7.62,10.12 7.62,8.94 7.11,8.43 IC7.2 4.47,8.43 | 11.18,59.33 TP18.TP 12.19,59.33 | 12.19,59.33 14.99,59.33 JP2.1 | C50.2 66.65,70.85 | 66.65,70.85 69.09,70.85 | 69.09,70.85 C51.2 | IC15.2 70.72,69.23 69.09,70.85 | v78.23,25.3 79.92,25.3 C18.2 | v65.64,73.05 65.64,71.87 66.65,70.85 | C31.2 29.53,31.7 28.25,31.7 27.74,32.21 IC17.2 27.74,34.04 | C30.2 25.2,33.53 26.01,34.34 27.43,34.34 27.54,34.24 | 27.74,34.04 27.54,34.24 | 27.74,34.04 27.74,34.24 | C43.2 35.52,71.06 36.12,70.46 | 36.12,70.46 36.88,69.7 IC11.2 | 36.72,71.06 C44.2 48.73,71.06 49.07,70.71 C45.2 49.24,71.22 52.12,71.22 52.88,70.46 | 36.72,71.06 36.12,70.46 | IC9.2 53.65,69.7 52.88,70.46 | C46.2 53.48,71.06 | 53.48,71.06 52.88,70.46 | v29.06,34.95 28.25,34.95 27.54,34.24 | 12.19,59.33 10.47,61.06 JP17.3 | v94.9,47.95 94.9,46.94 94.69,46.74 | IC11.4 36.86,71.2 36.72,71.06 | IC9.4 53.62,71.2 53.48,71.06 | 4.47,8.43 3.94,8.43 v3.61,8.1 | C2.2 6.3,5.38 5.08,6.6 5.08,7.82 4.47,8.43
  Bottom 0.254: R29.1 74.21,17.54 74.21,18.56 v73.36,19.41 74.21,20.26 R27.1 | R31.1 70.14,20.76 v68.78,19.41 | JP14.1 81.59,32.92 v81.79,33.12 | R41.1 78.44,21.95 79.66,20.73 79.66,19.3 79.66,18.09 v79.55,17.98 78.27,16.7 R43.1
  other vias: 19.1,2.03 15.44,14.22 17.68,45.52 50.19,55.88 11.38,39.83 16.46,32.92 46.94,72.75 53.65,64.21 35.97,64.62 70.51,64.21 7.72,52.83 17.68,51.61 10.36,71.63 30.99,60.96 2.44,44.81 64.92,59.44 81.48,72.14 28.55,52.22 2.54,17.68 26.82,10.26 91.64,31.39 96.93,27.53 78.03,45.21 32.72,47.65 71.93,52.53 87.48,42.06
  pour Route2: 0.05,77.99 99.65,78.03 99.77,-0.2 0.2,0
  pour Top (rank 2): 99.67,77.99 0.01,77.97 -0.1,-0.1 99.67,-0.1
HOLD
  Top 0.254: R39.2 R38.1 62.01,24.42 62.99,25.4 65.43,25.4 67.26,27.23 67.29,27.26 67.29,27.46 IC1.37
HOLD_T
  Top 0.254: R38.2 59.84,23.47 59.44,23.06 59.44,13.31 60.66,12.09 J1.A25
MUX_DAC_EN  (via drill 0.6)
  Top 0.254: IC21.15 52.46,49.65 v51.72,50.39
  Bottom 0.254: v51.72,50.39 51,49.68 50.9,49.58 50.9,34.34 50.09,33.53 50.09,33.33 50.09,23.06 59.29,13.77 59.39,13.67 J1.A24
MUX_DAC_SEL  (via drill 0.6)
  Top 0.254: IC21.1 50.49,40.02 v49.99,39.52
  Bottom 0.254: v49.99,39.52 50.09,39.42 50.09,34.34 49.48,33.73 49.48,33.53 49.48,22.76 54.76,17.27 57.96,14.07 58.12,13.92 J1.A23
MUX_REF_1  (via drill 0.6)
  Top 0.254: IC2.6 21.47,47.58 v21.85,47.95
  Bottom 0.254: J1.A13 45.42,17.78 44.71,18.49 43.49,19.71 37.39,25.81 35.97,27.23 35.97,36.98 32.92,40.03 25.81,40.03 24.59,40.03 22.15,42.47 22.15,47.65 v21.85,47.95
MUX_REF_2  (via drill 0.6)
  Top 0.254: IC3.6 21.58,36 v22.15,36.58
  Bottom 0.254: J1.A11 42.88,18.29 42.27,18.9 34.75,26.42 24.79,36.37 22.35,36.37 v22.15,36.58
MUX_REF_3  (via drill 0.6)
  Top 0.254: v18.29,17.68 18.29,16.26 19.71,14.83 19.71,14.3 IC4.6
  Bottom 0.254: J1.A9 40.34,11.68 34.75,17.27 19.51,17.27 18.7,17.27 v18.29,17.68
N$1
  Top 0.254: JP9.2 60.15,42.27 61.57,43.69 61.57,45.99 C36.2 | 62.52,46.53 C36.2 | C36.2 62.25,46.63 | C37.1 60.69,48.16 C36.2
N$2
  Top 0.508: R9.2 19.61,4.57 21.34,2.85 22.56,1.63 28.9,1.63 J1.B1
N$3
  Top 0.254: JP10.1 63.2,47.38 62.42,48.16 C37.2
N$4
  Route2 0.508: J1.A46 J1.A48
N$5
  Top 0.254: IC20.1 14.91,18.62 17.88,15.65 17.88,14.3 IC4.1
N$6
  Top 0.254: JP1.2 68.06,44.25 68.92,45.11 70.31,45.11 70.37,45.17 C38.1
N$9
  Bottom 0.254: JP13.1 81.59,28.35 83.92,30.68 83.92,30.99 JP19.2
N$10
  Top 0.406: C42.1 R8.2 94.53,10.91 94.53,6.93 J1.B50
N$17
  Top 0.254: IC18.1 14.41,48.99 16.66,46.74 19.31,46.74 IC2.1
N$19
  Top 0.254: IC19.1 17.7,34.37 18.49,35.15 19.62,35.15 IC3.1
OP_MODE  (via drill 0.6)
  Top 0.254: IC1.11 67.79,35.34 v69.29,33.83
  Bottom 0.254: v69.29,33.83 71.43,31.7 71.43,27.53 71.63,27.33 72.39,26.57 72.51,26.45 R26.1 R27.2
OP_MODE_T
  Bottom 0.254: R26.2 74.88,23.47 75.08,23.27 75.08,21.64 75.08,14.12 75.29,13.92 75.9,13.31 J1.A37
OUT_S
  Top 0.254: R32.1 R33.2 58.42,16.83 58.42,18.53 58.42,23.47 60.96,26.01 65.23,26.01 65.64,26.42 66.29,27.07 66.29,27.27 IC1.35
OUT_S_T
  Top 0.254: R32.2 56.25,13.24 56.8,12.7 56.85,12.65 J1.A22
POT_R1
  Top 0.254: R1.2 83.01,57.61 82.65,57.96 | 82.65,57.96 R1.3 | JP4.3 81.48,53.38 R1.2 | 83.07,54.97 R1.2 | TP27.TP 83.01,58.32 82.65,57.96
POT_R2
  Top 0.254: R2.1 77.89,58.99 75.9,57 | 75.9,57 75.39,56.49 75.39,56.08 R2.2 75.39,53.03 75.39,51.92 JP4.1 | 75.9,57 69.09,57 TP28.TP
POT_R4
  Top 0.254: 20.52,43.08 TP24.TP 20.07,42.32 19.97,42.22 19.51,41.76
  Top 0.406: R4.2 17.54,39.79 20.07,42.32 | 20.07,42.32 TP24.TP | IC2.3 19.57,42.81 20.07,42.32
POT_R5
  Top 0.406: IC3.3 19.68,33.59
  Top 0.508: 19.68,33.59 19.68,33.29 16.66,30.28 TP25.TP 13.62,26.52 R5.2
POT_R6
  Top 0.406: R6.2 14.33,9.75 TP26.TP 17.54,12.96 IC4.3
REF_ADC  (via drill 0.6)
  Top 0.254: C17.1 C18.1 83.11,25.6 v83.52,26.01 85.58,23.95 IC22.P$2 | IC24.P$2 44.94,26.83 C23.1 C24.1
  Top 0.508: C24.1 44.74,29.4 45.16,29.82 | 45.16,29.82 v45.92,30.58 | 45.16,29.82 45.01,29.67 35.16,29.67 32.82,29.67 TP17.TP 31.53,30.75 31.26,30.75 C31.1 29.14,30.75 IC17.5
  Route3 0.508: v83.52,26.01 81.99,26.01 78.94,22.96 49.48,22.96 48.46,23.98 48.46,28.04 v45.92,30.58
REFIN_DAC
  Top 0.254: IC23.10 47.06,41.77 47.14,41.86
  Top 0.406: IC8.5 41.35,51.13 41.92,51.13 C28.1 42.37,50.39 44.1,48.67 TP15.TP 45.84,46.82 46.53,46.13 46.53,44.7 47.14,44.09 47.14,41.86
RES_BIAS_EXT
  Top 0.254: IC1.6 70.29,38.18 71.93,39.83 74.37,39.83 75.39,40.84 75.39,45.31 78.03,47.95 78.94,48.87 JP4.2
RST
  Top 0.254: R36.1 R37.2 62.01,17.21 62.01,17.51 62.79,18.29 | 62.79,18.29 62.89,18.39 | IC1.38 67.79,27.15 67.79,26.94 67.77,26.92 66.45,25.6 65.64,24.79 64.01,24.79 62.99,23.77 62.99,18.49 62.79,18.29
RST_CSA  (via drill 0.6)
  Top 0.254: IC1.12 67.29,38.64 67.77,39.12 68.68,39.12 v68.78,39.22
  Bottom 0.254: R28.1 R29.2 72.51,17.72 71.63,18.59 71.63,26.21 71.32,26.52 70.82,27.03 70.82,30.07 67.77,33.12 67.77,38.2 v68.78,39.22
RST_CSA_T
  Bottom 0.254: R28.2 74.21,12.6 73.36,11.75 J1.A35
RST_T
  Top 0.254: R36.2 60.45,14.7 60.45,13.51 61.93,12.04 J1.A26
SDI_DAC  (via drill 0.6)
  Top 0.254: IC23.7 44.61,43.27 v43.79,44.09
  Bottom 0.254: v43.79,44.09 43.79,43.99 44.71,43.08 44.71,37.69 48.26,34.14 48.26,33.93 48.26,22.05 48.26,21.74 52.12,17.88 53.7,16.31 54.31,15.7 J1.A20
SDI_REF  (via drill 0.6)
  Top 0.254: IC18.5 9.49,47.1 9.25,47.35 9.04,47.55 v9.04,49.38 | IC20.5 9.41,16.32 v9.15,16.05 | IC19.5 9.19,32.06 v8.13,33.12
  Bottom 0.254: J1.A6 36.53,13.06 34.14,15.44 11.38,15.44 9.76,15.44 v9.15,16.05 6.3,18.9 6.3,32.11 | v9.04,49.38 7.72,49.38 6.3,47.95 6.3,32.92 6.3,32.11 | v8.13,33.12 7.32,33.12 6.3,32.11
SDO_ADC1
  Top 0.254: IC22.P$8 85.58,14.63 84.14,13.19 | J1.A43 83.52,12.57 84.14,13.19 | R3.1 83.85,12.9 84.14,13.19
SDO_ADC2
  Top 0.254: IC24.P$8 44.94,20.09 46.79,18.24 | 46.79,18.24 49.07,15.95 49.23,15.8 J1.A16 | R7.1 45.92,17.37 46.79,18.24
SGN
  Top 0.254: R35.2 R34.1 66.08,24.42 66.65,24.99 68.28,26.62 68.28,27.03 68.28,28.46 IC1.39
SGN_T
  Top 0.254: R34.2 63.91,23.47 63.5,23.06 63.5,12.9 63.5,9.45 63.4,9.35 63.2,9.14 J1.A27
V0NDAC
  Top 0.254: 54.36,40.04 IC21.5 54.37,38.52 54.37,38.42 53.54,37.59 53.34,37.39 50.8,37.39 49.99,38.2 49.48,38.71 48.46,39.73 48.46,41.76 48.98,42.27 IC23.2
V0PDAC
  Top 0.254: IC23.1 52.11,41.77 52.53,41.35 52.53,40.09 IC21.2
V1NDAC
  Top 0.254: IC21.14 53.14,45.48 53.14,44.4 52.51,43.77 IC23.5 50.28,43.77 50.9,44.4 50.9,45.76 C53.1
V1PDAC
  Top 0.254: IC21.11 54.97,45.48 54.97,43.99 54.25,43.27 IC23.4 48.78,43.27 48.67,43.38 47.92,44.13 C52.1
V_REF_PRECHAR  (via drill 0.6)
  Top 0.254: IC1.7 69.79,39.71 v70.31,40.23 | JP7.2 39.02,44.09 TP37.TP
  Top 0.406: TP37.TP 40.64,45.31
  Bottom 0.254: v70.31,40.23 70.51,40.44 70.51,46.94 68.28,49.17 65.03,52.43 45.42,52.43 40.95,47.95 40.95,44.81 40.24,44.09 JP7.2
V_REF_PRECHAR_BUFF
  Top 0.254: JP7.1 35.97,41.66 34.65,41.66 34.24,42.06 34.24,44.2 33.19,45.25 C34.1 31.58,46.29 IC14.1 30.13,45.66 29.63,45.66 29.49,45.8 IC14.2
VDD  (via drill 0.6)
  Top 0.254: IC21.16 51.83,47.54 51,48.36 C39.2 49.68,48.5 v49.68,50.39 | 40.54,42.77 v40.34,42.57 | IC23.8 44.4,42.77 | C1.1 4.88,27.84 5.49,27.23 v5.49,26.42 | v20.73,11.18 19.71,11.18 18.9,11.99 18.9,13.41 19.1,13.61 IC4.5 | IC20.2 13.66,20.57 v13.82,20.73 | C58.2 43.79,39.32 42.17,40.95 42.17,42.06 41.45,42.77
  Top 0.305: IC5.3 IC5.4 7.6,39.87 C3.1
  Top 0.406: C44.1 | IC6.3 IC6.4 4.41,29.29 C1.1 4.61,28.04 | IC2.5 20.73,45.82 20.42,46.13 20.42,47.14 20.02,47.55 v20.02,49.58 | v41.45,66.65 41.25,66.65 | 7.6,39.87 8.19,39.87 8.64,39.42 v8.64,38 | 40.54,42.77 41.45,42.77 44.4,42.77 | IC18.2 13.82,49.4 v13.82,51.41 | IC19.2 13.66,35.2 14.02,35.56 v16.26,35.56 | IC3.5 v23.67,34.44
  Top 0.508: IC7.3 IC7.4 9.55,6.85 v9.55,5.69 9.25,5.38 C2.1 | 40.6,68.52 40.62,68.52 | 40.62,68.52 C44.1 42.64,68.17 TP5.TP | IC11.3 39.21,67.11 40.15,68.05 | 40.15,68.05 40.62,68.52 | v41.45,66.65 41.45,66.75 40.15,68.05
  pour Route3: -0.02,78 99.68,77.98 99.77,0 0,0
VDD2  (via drill 0.6)
  Top 0.406: IC9.3 55.97,67.11 | IC13.3 80.2,42.65 C7.1 79.49,42.06 78.64,42.06 78.44,41.86 78.44,41.25 | IC13.4 80.9,40.05 80.27,39.42 79.05,39.42 78.44,40.03 78.44,41.25 | IC10.3 43.46,31.96 C5.1 44.77,31.96 45.52,32.72 45.52,33.73 44.91,34.34 43.49,34.34 | 43.49,34.34 43.24,34.34 IC10.4 | v77.01,42.27 77.42,42.27 78.44,41.25 | v42.47,35.76 42.47,35.36 43.49,34.34 | v58.73,65.84 58.73,67.77 59.13,68.17
  Top 0.508: 55.97,67.11 57.42,68.56 | 57.42,68.56 C46.1 | 57.42,68.56 57.81,68.17 59.13,68.17 TP6.TP
  Route3 0.406: v42.47,35.76 42.47,50.8 43.49,51.82 43.89,51.82 44.5,51.82 61.57,51.82 | v77.01,42.27 67.46,51.82 61.57,51.82 | 58.83,65.73 v58.73,65.84 60.15,64.41 60.15,63.8 60.15,53.24 61.57,51.82
VDD3  (via drill 0.6)
  Top 0.254: C16.1 C15.1 | 82.07,21.86 C15.1 | 82.4,22.19 C15.1 | C20.1 C19.1 41.61,23.89 IC24.P$4 | 39.49,23.98 C20.1 | 38,24.99 39.22,23.77 | 39.22,23.77 39.69,23.77 C20.1 | 39.22,23.77 38,24.99 | 38,24.99 38,27.53 v37.9,27.64
  Top 0.406: C16.1 80.2,21.78 | IC16.4 92.01,45.8 C25.1 91.5,47.24 | IC12.8 23.45,19.07 23.98,19.61 v25.1,19.61 | IC14.8 31.74,41.09 32.56,41.09 v32.62,41.15
  Top 0.508: IC15.3 73.04,66.9 74.59,68.46 C51.1 75.29,67.56 TP45.TP 77.01,65.84 v77.01,63.09 | IC22.P$4 83.31,22.19 82.4,22.19 C15.1 | 80.2,21.78 79.29,21.78 78.44,20.93 78.44,19.81 v78.54,19.71 | v21.95,31.29 22.35,30.89 23.57,30.89 25.14,30.89 C30.1 26.14,30.95 IC17.4 IC17.3 | IC8.4 IC8.3 37.57,53.73 37.03,53.19 | C4.1 37.29,52.93 37.03,53.19 | 37.03,53.19 v36.27,53.95 | 91.5,47.24 v90.12,47.24 | IC16.3 IC16.4
  Route3 0.406: 35.76,38.81 35.56,39.01 33.94,39.01 33.83,39.01 32.62,40.23 v32.62,41.15
  Route3 0.508: v25.1,19.61 25.1,20.42 25.1,26.01 | 25.1,26.01 25.1,29.06 | 25.1,29.06 25.1,37.69 25.1,38.71 | 25.1,26.01 26.62,27.53 35.76,36.68 35.76,38.2 | v21.95,31.29 22.86,31.29 25.1,29.06 | v77.01,63.09 77.52,62.18 82.4,62.18 82.7,62.18 88.39,56.49 88.39,45.92 | 35.76,38.2 35.76,27.23 35.76,26.21 | 35.76,26.21 35.76,24.99 37.8,22.96 39.83,20.93 74.37,20.93 75.59,19.71 v78.54,19.71 82.3,23.47 86.06,23.47 87.89,25.3 88.39,25.81 89.92,27.33 89.92,42.67 89.41,43.18 88.39,44.2 88.39,45.92 | v36.27,53.95 36.27,50.39 37.59,49.07 37.59,40.95 35.76,39.12 35.76,38.81 35.76,38.2 | v37.9,27.64 37.19,27.64 35.76,26.21 | v90.12,47.24 89.71,47.24 88.39,45.92
VDD_REF_1
  Top 0.305: IC5.5 7.6,44.36 C26.1
  Top 0.406: IC5.5 11.35,43.22 R4.1 13.76,43.65 IC18.7
  Top 0.508: C26.1 7.15,46.8 TP41.TP
VDD_REF_2
  Top 0.254: IC6.5 5.1,31.8 6.61,31.8 7.11,31.29 7.66,30.74 R5.1
  Top 0.406: R5.1 12.15,29.02 13.62,30.48 13.62,32.02 IC19.7
  Top 0.508: 5.1,31.8 5.1,33.11 5.1,33.33 | 5.1,33.33 5.1,34.94 TP42.TP | C27.1 4.99,33.43 5.1,33.33
VDD_REF_3
  Top 0.406: TP43.TP 11.99,13.51 12.7,13.51
  Top 0.508: R6.1 11.83,8.09 11.28,8.64 10.53,9.38 9.52,9.38 IC7.5 8.92,10.52 C35.1 8.74,10.97 TP43.TP | IC20.7 13.66,15.18 11.99,13.51
VDD_SUPPLY_1
  Top 0.508: JP5.1 22.86,65.94 TP1.TP 30.93,67.97 31.13,68.17 C43.1 32.31,69.34 IC11.1 34.56,67.11
VDD_SUPPLY_2
  Top 0.508: JP8.1 TP3.TP 47.63,63.4 49.01,64.78 | 47.83,63.6 49.01,64.78 | 49.01,64.78 IC9.1 49.09,69.33 49.09,69.36 C45.1
VDD_SUPPLY_3
  Top 0.508: IC15.1 66.15,69.15 C50.1 66.08,69.09 65.03,69.09 58.93,75.18 54.46,75.18 29.36,75.18 29.26,75.18 26.62,72.54 TP44.TP 20.83,68.48 JP20.1 19.31,68.48
VDD_SUPPLY_IN_1
  Top 0.508: 14.43,66.95 16.51,66.95 JP5.2 | JP20.2 15.95,68.48 14.43,66.95 | 14.43,66.95 TP2.TP 3.76,66.95 JP17.1
VDD_SUPPLY_IN_2
  Top 0.508: JP8.2 TP4.TP 3.15,63.4 JP17.2
VI+_FIL
  Top 0.254: JP11.2 60.81,36.12 62.79,34.14 62.81,34.12 IC1.22
VI+_FIL_DAC  (via drill 0.6)
  Top 0.254: JP11.1 58.73,36.68 58.76,36.68 C54.1 | IC21.4 53.73,38.59 53.54,38.41 v52.33,38.41
  Bottom 0.254: v52.33,38.41 56.54,38.41 JP11.1
VI-_FIL
  Top 0.254: IC1.23 61.41,33.62 60.41,33.62 JP12.2
VI-_FIL_DAC
  Top 0.254: JP12.1 56.15,35.34 55.96,35.53 | IC21.7 55.64,36.68 55.64,35.85 55.96,35.53 | C55.1 54.97,34.54 55.96,35.53
VICM  (via drill 0.6)
  Top 0.254: IC1.40 68.79,29.77 v68.68,29.87 | JP15.2 30.18,21.95 30.68,21.44 32.72,21.44 35.56,18.59 35.56,17.07 37.29,15.34 37.29,14.83 TP12.TP | JP15.2 30.18,23.98 JP15.2 | IC21.3 53.1,41.21 53.34,41.45 54.76,41.45 54.97,41.25 55.01,41.21 IC21.6 55.01,38.24 53.65,36.88 52.83,36.88 v52.22,36.27
  Route2 0.254: JP15.2 30.18,22.96 30.38,22.96 31.9,21.44 54.56,21.44 61.37,28.25 67.06,28.25 v68.68,29.87 68.68,31.39 68.68,32.92 67.06,34.54 65.53,34.54 64.82,35.26 56.59,35.26 55.58,36.27 v52.22,36.27
VICM_BUFF
  Top 0.254: IC12.2 IC12.1 23.73,23.71 C32.1 27.4,23.71 JP15.1
VICM_MUX
  Top 0.254: TP11.TP 21.03,27.03 | 21.03,27.03 TP11.TP | 20.4,27.41 TP11.TP | JP15.3 32.72,24.99 30.68,27.03 20.83,27.03 TP11.TP | TP11.TP 21.03,27.53 TP11.TP | 21.03,27.03 21.03,33.25 IC3.4 | TP11.TP 19.81,26.52 19.24,25.95 C47.1 | IC12.3 20.91,25.93 TP11.TP
VIN_CSA
  Top 0.254: JP1.3 65.79,41.25 IC1.15 | JP10.2 JP1.3 | JP1.3 65.38,41.71 64.62,42.47 64.62,44.91 65.23,45.52 68.48,45.52 69.09,46.13 71.83,48.87 TP20.TP
VIN_CSA_1
  Top 0.254: JP9.1 60.35,44.45 60.35,45.31 | 60.35,46.27 C36.1 60.35,46.47 60.35,45.31 | IC21.9 56.28,46.01 56.59,46.33 58.12,46.33 | 58.12,46.33 59.34,46.33 60.35,45.31 | C56.1 57.68,45.9 58.12,46.33
VL_ADC  (via drill 0.6)
  Top 0.254: IC24.P$7 44.04,19.72 C21.1 C22.1 43.73,17.21 43.38,16.87 | v40.84,16.36 42.88,16.36 43.38,16.87 | 43.38,16.87 44.6,15.65 45.76,14.49 R7.2 | TP16.TP 91.64,41.49 C29.1 | C14.1 C8.1 84.02,17.88 84.68,18.54 IC22.P$7 | R3.2 80.33,14.09 80.88,14.63 v83.21,14.63
  Top 0.406: IC16.5 91.81,42.8 C29.1 91.81,41.49 v93.68,39.62 | C14.1 83.35,15.1 v83.21,14.63
  Route3 0.406: v40.84,16.36 42.37,14.83 45.42,11.79 84.94,11.79 89.82,16.66 | 89.82,16.66 89.97,16.82 | 89.97,16.82 93.27,20.12 93.88,20.73 93.88,39.42 v93.68,39.62 | 89.82,16.66 89.97,16.82 | 89.82,16.66 86.67,16.66 85.24,16.66 v83.21,14.63
VO+_BP_FIL
  Top 0.254: IC1.24 62.58,33.12 61.98,32.51 61.57,32.11 56.49,32.11 JP3.3
VO+_CH
  Top 0.254: IC1.50 74.32,29.62 74.73,29.62 JP13.3
VO+_FIL
  Top 0.254: JP3.1 58.93,24.99 61.16,27.23 62.99,27.23 63.81,28.04 63.81,29.87 64.01,30.07 64.05,30.12 IC1.30
VO-_BP_FIL  (via drill 0.6)
  Top 0.254: IC1.25 63.51,32.62 v62.99,32.11
  Bottom 0.254: v62.99,32.11 55.68,32.11 | 55.68,32.11 55.07,32.11 | JP18.3 51.72,30.79 53.04,32.11 55.68,32.11
VO-_CH
  Top 0.254: IC1.52 75.86,30.62 JP14.3
VO-_FIL  (via drill 0.6)
  Top 0.254: IC1.31 65.08,29.62 65.64,30.18 65.64,30.89 66.04,31.29 v66.65,31.29
  Bottom 0.254: JP18.1 51.72,24.89 53.24,23.37 55.48,23.37 62.18,30.07 63.4,31.29 v66.65,31.29
VOCM  (via drill 0.6)
  Top 0.254: IC1.36 66.79,29.12 66.65,29.26 66.14,29.26 65.79,28.91 IC1.34 65.79,27.59 65.43,27.23 v64.62,27.23 | TP14.TP 29.67,18.39 JP16.2
  Route2 0.254: v64.62,27.23 61.37,27.23 54.87,20.73 32.01,20.73 | 32.01,20.73 31.7,20.42 | 31.7,20.42 JP16.2 | 32.01,20.73 31.7,20.42
VOCM_1
  Top 0.254: IC2.4 25,45.17 C49.1 25.16,45.66 26.42,44.4 27.64,44.4 28.14,44.91 28.14,46.21 IC14.3 28.22,48.74 28.75,49.28 30.68,49.28 TP30.TP 32.62,50.09 JP7.3
VOCM_BUFF
  Top 0.254: IC12.6 21.05,18.09 22.15,18.09 22.18,18.11 IC12.7 22.18,16.94 22.76,16.36 23.88,16.36 24.28,16.76 25.1,17.58 C33.1 26.45,17.72 JP16.1
VOCM_MUX
  Top 0.254: JP16.3 31.09,20.52 30.89,20.73 20.32,20.73 19.64,20.04 IC12.5 | C48.1 15.95,19.61 16.87,18.69 19.17,18.69 IC12.5 | IC4.4 19.79,13.01 20.93,13.01 23.06,13.01 TP13.TP 22.86,14.63 22.76,14.63 21.74,15.65 21.54,15.85 20.02,15.85 19.74,16.13 19.74,17.65 19.74,18.12 IC12.5
VOUT_CSA
  Top 0.254: IC1.54 74.6,31.62 75.08,32.11 82.2,32.11 83.21,31.09 83.21,30.38 JP19.3 84.63,28.96 TP9.TP
VSS  (via drill 0.6)
  Top 0.406: v17.88,23.37 19.58,23.37 IC12.4
  Top 0.508: JP17.4 3.56,58.52 7.32,58.52 10.97,54.86 12.09,54.86 TP39.TP | IC14.4 26.95,48.54 v26.11,49.38
  Route3 0.508: 18.49,41.76 15.7,44.55 15.44,44.81 9.35,44.81 8.64,44.81 3.56,49.89 3.05,50.39 3.05,57.91 3.05,58.42 JP17.4 | 18.49,41.76 18.49,24.99 18.49,23.98 v17.88,23.37 | 18.49,41.76 20.83,41.76 | 20.83,41.76 21.34,41.76 | v26.11,49.38 26.11,45.62 22.25,41.76 20.83,41.76

## Text on the board
bPlace: 2015 | IC-UC | WAC v08
tNames: TP44 | C43 | C44 | C45 | C46 | C51 | TP5 | TP6 | TP2 | TP1 | C50 | JP17 | JP5 | TP45 | VDD1 | JP8 | VDD2 | TP27 | TP4 | TP3 | GND | VSS | JP2 | TP19 | TP31 | TP36 | TP18 | JP6 | TP28 | TP39 | TP29 | C28 | TP30 | C57 | JP4 | C4 | TP41 | IC8 | TP15 | TP20 | IC18 | C37 | TP7 | JP7 | C39 | C25 | IC2 | C49 | TP37 | C53 | C36 | TP23 | C34 | C52 | C38 | IC16 | C26 | IC14 | TP21 | IC13 | IC5 | C56 | C7 | C41 | C29 | TP24 | JP21 | IC23 | JP9 | JP10 | JP1 | C3 | JP22 | TP42 | TP23 | C54 | AVDD | DVDD | C6 | C9 | C10 | TP34 | JP11 | TP8 | TP16 | C27 | C55 | IC3 | C5 | TP10 | IC6 | IC19 | JP12 | JP14 | C30 | TP17 | C40 | TP38 | IC17 | C31 | IC10 | JP13 | TP25 | TP11 | C24 | C13 | C12 | C11 | JP19 | C1 | C23 | TP9 | C32 | JP15 | C18 | C47 | R38 | R34 | R18 | R22 | C17 | TP32 | C20 | C19 | JP18 | JP3 | C15 | IC24 | TP35 | IC12 | R39 | R35 | R19 | R23 | C16 | C48 | JP16 | IC22 | TP33 | C21 | C22 | R33 | R37 | R15 | R17 | R21 | R25 | C8 | IC20 | C33 | R7 | C14 | IC4 | C42 | R32 | R36 | R14 | R16 | R20 | R24 | TP14 | TP12 | R8 | C35 | TP43 | TP26 | TP13 | R3 | IC7 | R9 | C2
bNames: R30 | R28 | R40 | R31 | R27 | R41 | R29 | R43 | R28 | R42